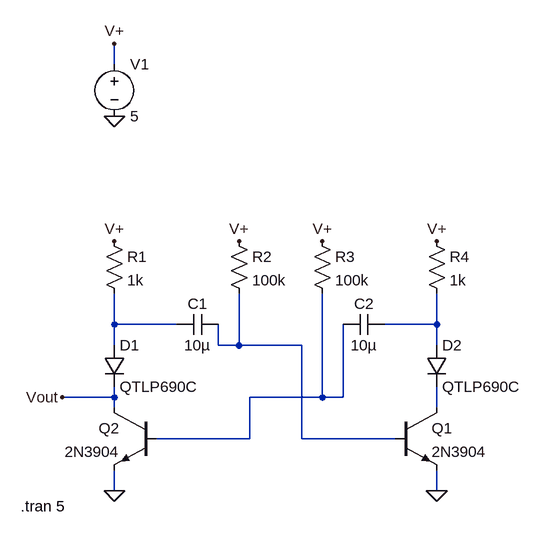
[diagram p0: schematic 06B-03.asc]
06B-03.asc, the LTspice schematic file:
Version 4.1
SHEET 1 880 680
WIRE -96 -336 -96 -368
WIRE -96 64 -96 16
WIRE 0 64 -96 64
WIRE 400 64 400 16
WIRE 400 64 320 64
WIRE -96 96 -96 64
WIRE 64 96 64 64
WIRE 96 96 96 16
WIRE 96 96 64 96
WIRE 192 96 96 96
WIRE 400 96 400 64
WIRE -96 176 -96 160
WIRE -96 176 -176 176
WIRE 224 176 224 16
WIRE 224 176 112 176
WIRE 256 176 256 64
WIRE 256 176 224 176
WIRE -96 192 -96 176
WIRE 400 192 400 160
WIRE 112 240 112 176
WIRE 112 240 -32 240
WIRE 192 240 192 96
WIRE 336 240 192 240
WIRE -96 320 -96 288
WIRE 400 320 400 288
FLAG -96 320 0
FLAG 400 320 0
FLAG -96 -64 V+
FLAG 96 -64 V+
FLAG 224 -64 V+
FLAG 400 -64 V+
FLAG -176 176 Vout
FLAG -96 -256 0
FLAG -96 -368 V+
SYMBOL npn 336 192 R0
SYMATTR InstName Q1
SYMATTR Value 2N3904
SYMBOL npn -32 192 M0
SYMATTR InstName Q2
SYMATTR Value 2N3904
SYMBOL cap 64 48 R90
WINDOW 0 0 32 VBottom 2
WINDOW 3 32 32 VTop 2
SYMATTR InstName C1
SYMATTR Value 10µ
SYMBOL cap 320 48 R90
WINDOW 0 0 32 VBottom 2
WINDOW 3 32 32 VTop 2
SYMATTR InstName C2
SYMATTR Value 10µ
SYMBOL res -112 -80 R0
SYMATTR InstName R1
SYMATTR Value 1k
SYMBOL res 80 -80 R0
SYMATTR InstName R2
SYMATTR Value 100k
SYMBOL res 208 -80 R0
SYMATTR InstName R3
SYMATTR Value 100k
SYMBOL res 384 -80 R0
SYMATTR InstName R4
SYMATTR Value 1k
SYMBOL diode -112 96 R0
SYMATTR InstName D1
SYMATTR Value QTLP690C
SYMATTR Description Diode
SYMATTR Type diode
SYMBOL diode 384 96 R0
SYMATTR InstName D2
SYMATTR Value QTLP690C
SYMATTR Description Diode
SYMATTR Type diode
SYMBOL voltage -96 -352 R0
WINDOW 123 0 0 Left 0
WINDOW 39 0 0 Left 0
SYMATTR InstName V1
SYMATTR Value 5
TEXT -240 344 Left 2 !.tran 5

The netlist it stands for:
* 06B-03.asc
Q1 N005 N003 0 0 2N3904
Q2 Vout N004 0 0 2N3904
C1 N003 N001 10µ
C2 N002 N004 10µ
R1 V+ N001 1k
R2 V+ N003 100k
R3 V+ N004 100k
R4 V+ N002 1k
D1 N001 Vout QTLP690C
D2 N002 N005 QTLP690C
V1 V+ 0 5
.model D D
.lib standard.dio
.model NPN NPN
.model PNP PNP
.lib standard.bjt
.tran 5
.backanno
.end